# EAGLE design speech1 (EAGLE 7.6.0)
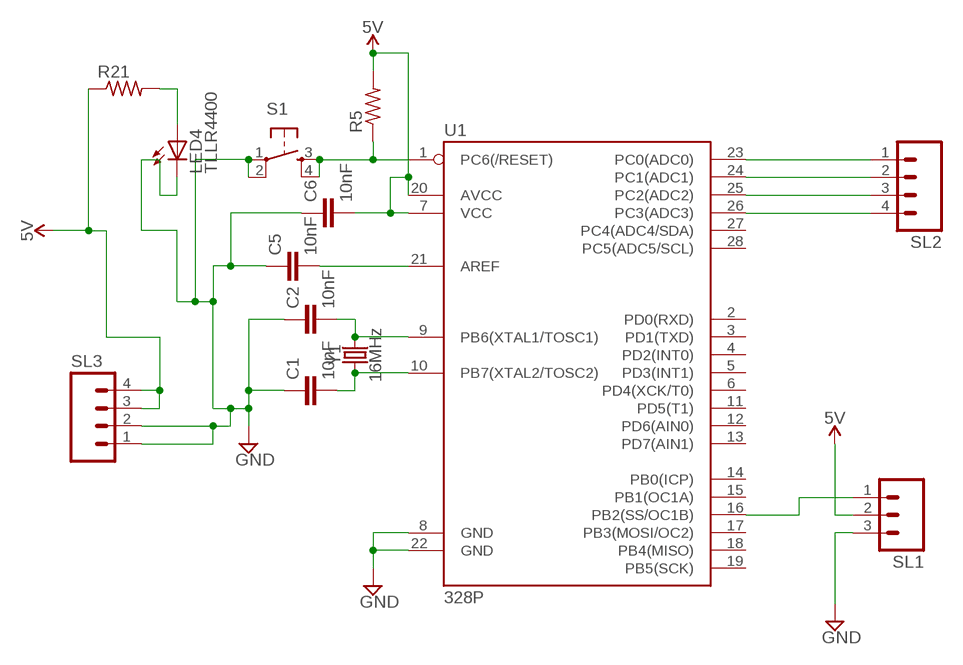
[diagram p0: schematic, sheet 1]

## Parts
C1  10nF  10NF-PTH-10MM-10000V-1-%  [CAP-PTH-10MM]
C2  10nF  10NF-PTH-10MM-10000V-1-%  [CAP-PTH-10MM]
C5  10nF  10NF-PTH-10MM-10000V-1-%  [CAP-PTH-10MM]
C6  10nF  10NF-PTH-10MM-10000V-1-%  [CAP-PTH-10MM]
LED4  TLLR4400  [LED3MM]
R5  R-US_0207/12  [0207/12]
R21  R-US_0207/12  [0207/12]
S1  TAC_SWITCHPTH  [TACTILE-PTH]
SL1  MA03  [03P]
SL2  MA04  [04PA]
SL3  MA04  [04PA]
U1  328P  ATMEGA328P_PDIP  [DIP28]
Y1  16MHz  CRYSTAL-16MHZPTH-HC49US  [HC49US]

## Nets
5V: C6.2 R5.2 R21.1 SL1.2 SL3.3 SL3.4 U1.7(VCC) U1.20(AVCC)
GND: C1.1 C2.1 C5.1 C6.1 LED4.K(C) S1.1 S1.2 SL1.3 SL3.1 SL3.2 U1.8(GND) U1.22(GND)
N$1: SL2.1 U1.23(PC0(ADC0))
N$2: SL2.2 U1.24(PC1(ADC1))
N$3: C2.2 U1.9(PB6(XTAL1/TOSC1)) Y1.2
N$4: C1.2 U1.10(PB7(XTAL2/TOSC2)) Y1.1
N$5: LED4.A R21.2
N$6: C5.2 U1.21(AREF)
N$7: SL2.3 U1.25(PC2(ADC2))
N$8: SL2.4 U1.26(PC3(ADC3))
N$9: R5.1 S1.3 S1.4 U1.1(PC6(/RESET))
N$10: SL1.1 U1.16(PB2(SS/OC1B))
Unconnected: U1.2(PD0(RXD)) U1.3(PD1(TXD)) U1.4(PD2(INT0)) U1.5(PD3(INT1)) U1.6(PD4(XCK/T0)) U1.11(PD5(T1)) U1.12(PD6(AIN0)) U1.13(PD7(AIN1)) U1.14(PB0(ICP)) U1.15(PB1(OC1A)) U1.17(PB3(MOSI/OC2)) U1.18(PB4(MISO)) U1.19(PB5(SCK)) U1.27(PC4(ADC4/SDA)) U1.28(PC5(ADC5/SCL))

## Library data of the parts
C1 C2 C5 C6 = SparkFun-Capacitors:10NF: 0.01uF/10nF/10,000pF ceramic capacitors A capacitor is a passive two-terminal electrical component used to store electrical energy temporarily in an electric field. CAP-09321; PROD_ID: CAP-09321
LED4 = led:TLLR4400: Low Current (2mA) LED 3 mm Tinted Diffused Package color RED Source: Data sheet <http://www.farnell.com/datasheets/391100.pdf>; MF: VISHAY SEMICONDUCTOR; OC_FARNELL: 1612437
R5 R21 = rcl:R-US_: RESISTOR, American symbol
S1 = SparkFun-Retired:TAC_SWITCH: Momentary Switch Button commonly used for reset or general input. Spark Fun Electronics SKU : COM-00097 SMT- SWCH-08247
SL1 = con-amp-quick:MA03: AMP QUICK CONNECTOR; OC_FARNELL: unknown; OC_NEWARK: unknown
SL2 SL3 = con-amp-quick:MA04: AMP QUICK CONNECTOR; OC_FARNELL: unknown; OC_NEWARK: unknown
U1 = SparkFun-IC-Microcontroller:ATMEGA328P_PDIP: Atmel 328P Through hole ATMEGA328P uC used in the Arduino 32kb flash, 1k EEPROM, 2k SRAM Datasheet <http://www.sparkfun.com/datasheets/Components/SMD/ATMega328.pdf> SparkFun Products Storefront component: AVR 28 Pin 20MHz 32K 6A/D - ATMega328P <https://www.sparkfun.com/products/9061> (COM-09061) SparkFun Simon Says - Through-Hole Soldering Kit <https://www.sparkfun.com/products/10547> (KIT-10547) SparkFun Learn to Solder - Simon Says <https://www.sparkfun.com/products/13708> (KIT-13708) SparkFun BigTime Watch Kit <https://www.sparkfun.com/products/11734> (KIT-11734) SparkFun ClockIt <https://www.sparkfun.com/products/10930> (KIT-10930) SparkFun Serial Enabled LCD Kit <https://www.sparkfun.com/products/10097> (LCD-10097) SparkFun Simon Tilts - Through Hole Soldering Kit <https://www.sparkfun.com/products/12634> (KIT-12634) SparkFun Frequency Counter Kit <https://www.sparkfun.com/products/10140> (KIT-10140) FabFM Radio Kit <https://www.sparkfun.com/products/11043> (KIT-11043) SparkFun Binary Blaster Kit <https://www.sparkfun.com/products/12037> (KIT-12037) SparkFun Metro-Gnome <https://www.sparkfun.com/products/9236> (KIT-09236) ATmega328 with Arduino Optiboot (Uno) <https://www.sparkfun.com/products/10524> (DEV-10524); PROD_ID: IC-09136
Y1 = SparkFun-Clocks:CRYSTAL-16MHZ: 16MHz Crystal Digikey Example <http://www.digikey.com/product-search/en?keywords=535-9122-1-ND> Frequency: 16MHz Frequency Stability: ±50ppm Frequency Tolerance: ±20ppm Load Capacitance: 18pF SparkFun Products: Pro Micro -5V/16MHz <https://www.sparkfun.com/products/12640> SparkFun Serial Enabled LCD Kit <https://www.sparkfun.com/products/10097>; PROD_ID: XTAL-08181; SF_ID: COM-00536

## Board
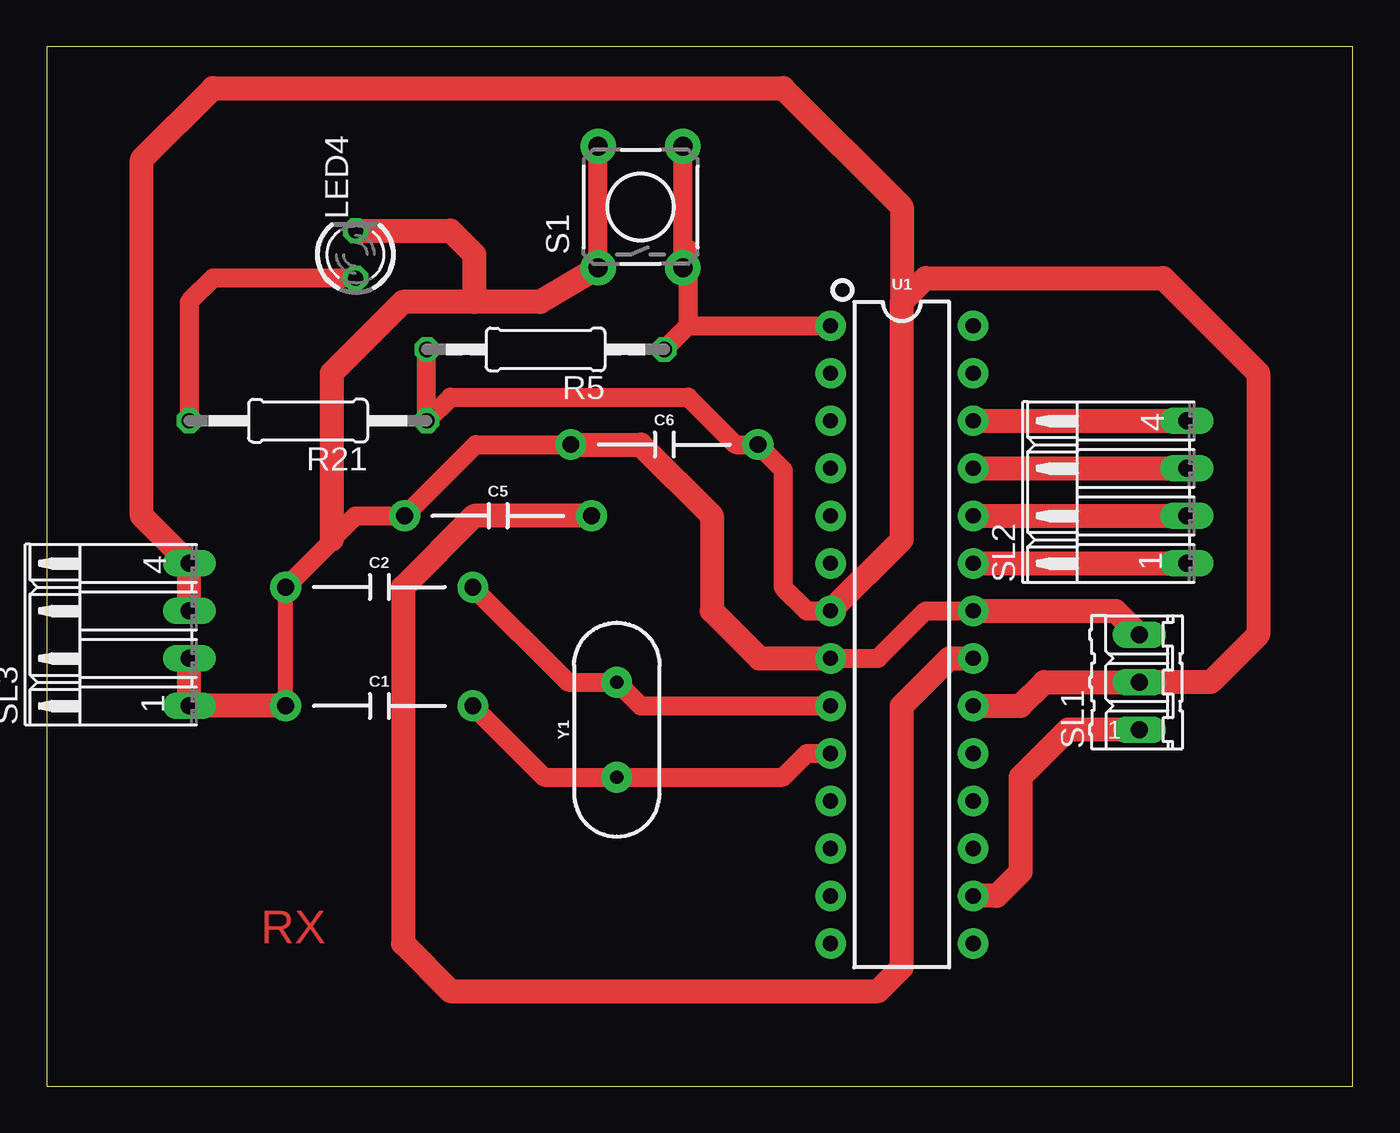
[diagram p1: board, top side]

Size 69.83 x 55.55 mm. Coordinates in mm from the lower left corner, seen from the top.
Outline: 0,0 69.83,0 69.83,55.55 0,55.55 0,0
Copper layers (1*16): Top 0.035mm / dielectric 1.5mm / Bottom 0.035mm
Design rules "default": minimum track width 10mil, minimum drill 24mil, track to track 8mil, track to pad 8mil, pad to pad 8mil, via to via 8mil, smd to smd 8mil, copper to edge 40mil, drill to drill 8mil, minimum pad ring 10mil, minimum via ring 8mil, stop-mask expansion 4mil, vias tented up to drill 0mil, thermal gap 10mil

### Footprints (pad centres in the part's own frame; a part is rotated, then mirrored left to right if it is on the bottom)
CAP-PTH-10MM = drill 0.9 pad 1.651: 1 -5,0; 2 5,0
LED3MM = drill 0.813 octagon: A -1.27,0; K 1.27,0
0207/12 = drill 0.813 octagon: 1 -6.35,0; 2 6.35,0
TACTILE-PTH = drill 1.016 pad 1.88: 1 -3.251,2.261; 2 3.251,2.261; 3 -3.251,-2.261; 4 3.251,-2.261
03P = drill 0.914 long: 1 -2.54,0; 2 0,0; 3 2.54,0
04PA = drill 0.914 long: 1 -3.81,0; 2 -1.27,0; 3 1.27,0; 4 3.81,0
DIP28 = drill 0.813 pad 1.626: 1 -16.51,-3.81; 2 -13.97,-3.81; 3 -11.43,-3.81; 4 -8.89,-3.81; 5 -6.35,-3.81; 6 -3.81,-3.81; 7 -1.27,-3.81; 8 1.27,-3.81; 9 3.81,-3.81; 10 6.35,-3.81; 11 8.89,-3.81; 12 11.43,-3.81; 13 13.97,-3.81; 14 16.51,-3.81; 15 16.51,3.81; 16 13.97,3.81; 17 11.43,3.81; 18 8.89,3.81; 19 6.35,3.81; 20 3.81,3.81; 21 1.27,3.81; 22 -1.27,3.81; 23 -3.81,3.81; 24 -6.35,3.81; 25 -8.89,3.81; 26 -11.43,3.81; 27 -13.97,3.81; 28 -16.51,3.81
HC49US = drill 0.7 pad 1.651: 1 -2.54,0; 2 2.54,0

### Placement (x,y rotation side)
C1  17.78,20.32 0 top
C2  17.78,26.67 0 top
C5  24.13,30.48 0 top
C6  33.02,34.29 0 top
LED4  16.51,44.45 90 top
R5  26.67,39.37 180 top
R21  13.97,35.56 180 top
S1  31.75,46.99 90 top
SL1  58.42,21.59 90 top
SL2  60.96,31.75 90 top
SL3  7.62,24.13 90 top
U1  45.72,24.13 270 top
Y1  30.48,19.05 90 top

### Tracks (layer width: path | path; a pad name or v marks a point on that pad's centre or on a via)
5V
  Top 1.016: R5.2 R21.1 21.59,36.83 34.29,36.83 36.83,34.29 C6.2 39.37,32.94 39.37,26.67 40.64,25.4 U1.7
  Top 1.27: U1.20 52.07,20.32 53.34,21.59 SL1.2 62.23,21.59 64.77,24.13 64.77,38.1 59.69,43.18 46.99,43.18 45.72,41.91 | U1.7 45.72,29.21 45.72,41.91 | SL3.3 SL3.4 5.08,30.48 5.08,49.53 8.89,53.34 39.37,53.34 45.72,46.99 45.72,41.91
GND
  Top 0.813: C1.1 C2.1
  Top 1.016: C2.1 15.24,29.13 15.24,29.21 16.51,30.48 C5.1 22.94,34.29 C6.1 | S1.1 S1.2 | U1.8 44.45,22.86 46.99,25.4 U1.22
  Top 1.27: U1.22 57.15,25.4 SL1.3 | C6.1 31.75,34.29 35.56,30.48 35.56,25.4 38.1,22.86 U1.8 | S1.1 26.39,41.91 22.86,41.91 | 22.86,41.91 19.05,41.91 15.24,38.1 15.24,29.21 | C1.1 SL3.1 SL3.2 | LED4.K 21.59,45.72 22.86,44.45 22.86,41.91
N$1
  Top 1.27: U1.23 SL2.1
N$2
  Top 1.27: U1.24 SL2.2
N$3
  Top 1.016: C2.2 27.86,21.59 Y1.2 31.75,20.32 U1.9
N$4
  Top 1.016: U1.10 40.64,17.78 39.37,16.51 Y1.1 26.59,16.51 C1.2
N$5
  Top 1.016: LED4.A 8.89,43.18 7.62,41.91 R21.2
N$6
  Top 1.27: C5.2 22.86,30.48 19.05,26.67 19.05,7.62 21.59,5.08 44.45,5.08 45.72,6.35 45.72,20.32 48.26,22.86 U1.21
N$7
  Top 1.27: U1.25 SL2.3
N$8
  Top 1.27: U1.26 SL2.4
N$9
  Top 1.016: S1.4 S1.3 34.29,44.73 34.29,40.64 | R5.1 34.29,40.64 | 34.29,40.64 U1.1
N$10
  Top 1.27: SL1.1 54.61,19.05 52.07,16.51 52.07,11.43 50.8,10.16 U1.16

### Text on the board
Top: RX